# Altium schematic sheet PWM_5.8A_30V.SchDoc: PWM 30V/4A
size A4; DocumentNumber: 13; Revision: 5; SheetNumber: 14; SheetTotal: 77; Organization: Altium Limited.
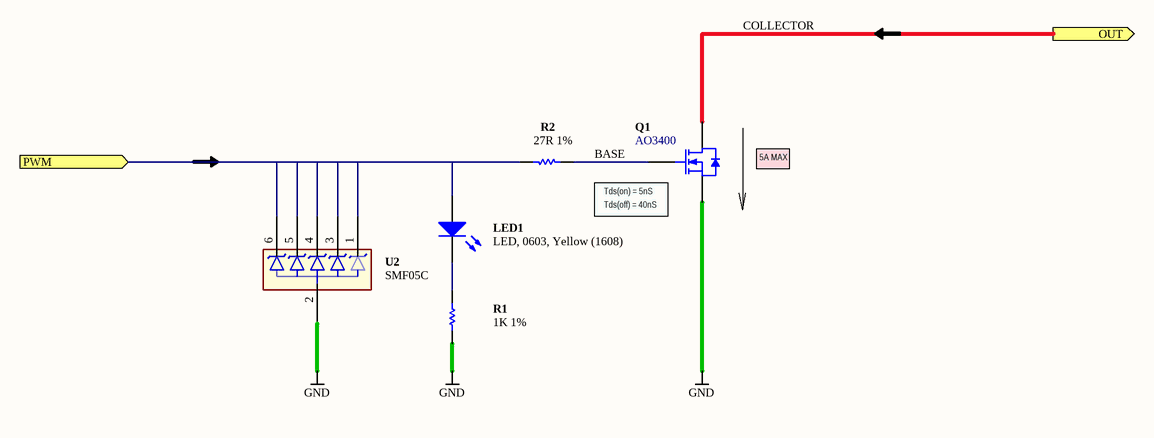
[diagram p0: PWM_5.8A_30V.SchDoc]

## Parts
LED1  LED, 0603, Yellow (1608)  [0603LED_YELLOW]
Q1  AO3400  [SOT95P230-3D]
R1  1K 1%  [RESC1005-STAR]
R2  27R 1%  [RESC1005-STAR]
U2  SMF05C  [SC70_6L]

## Ports
OUT (out), PWM (in)

## Nets
GND: Q1.3(S) R1.1 U2.2
BASE: Q1.1(G) R2.2
COLLECTOR: Q1.2(D) ; port OUT
PWM: LED1.1(A) R2.1 U2.1 U2.3 U2.4 U2.5 U2.6 ; port PWM
NetLED1_2: LED1.2(K) R1.2

## Notes on the sheet
- (near Q1) Tds(on) = 5nS
- (near Q1) Tds(off) = 40nS
- 5A MAX
- Sheet Title
- Project Title
- Size:
- Date:
- A4
- Assy:
- Time:
- Revision:
- Sheet
- of
- File:

## Library data of the parts
LED1 = D-153-0007: Brightness: 120mcd; Color: Yellow/Amber; Peak Wave Length: nm; Category: LED; Mounting Technology: Surface Mount; Status: Production
Q1 = D-158-0005: N-channel Enhancement Mode Field-effect Transistor;  5.8A/30V; Transistor Type: NPN; Mounting Technology: Surface Mount; Status: Unreleased; Category: Transistor-FET
R1 = D-100-0121: Resistor, 1K 1% 0402 (1005); Power Rating: 63 mW; Category: Resistor; Mounting Technology: Surface Mount; Resistance: 1 K; Status: Production; Tolerance: 1 %
R2 = D-100-0108: Resistor, 27R 1% 0402 (1005); Power Rating: 63mW; Category: Resistor; Mounting Technology: Surface Mount; Resistance: 27R; Status: Production; Tolerance: 1%
U2 = D-157-0000: TVS Diode Array  For ESD and Latch-Up Protection; Junction Capacitance: 130 pF; Peak Pulse Current: 8 A; Peak Pulse Power: 100 W; Reverse Breakdown Voltage: 6 V; Status: Unreleased; Category: Diode-Protection